# Altium schematic sheet circuit_print_NCKH.SchDoc
size A4
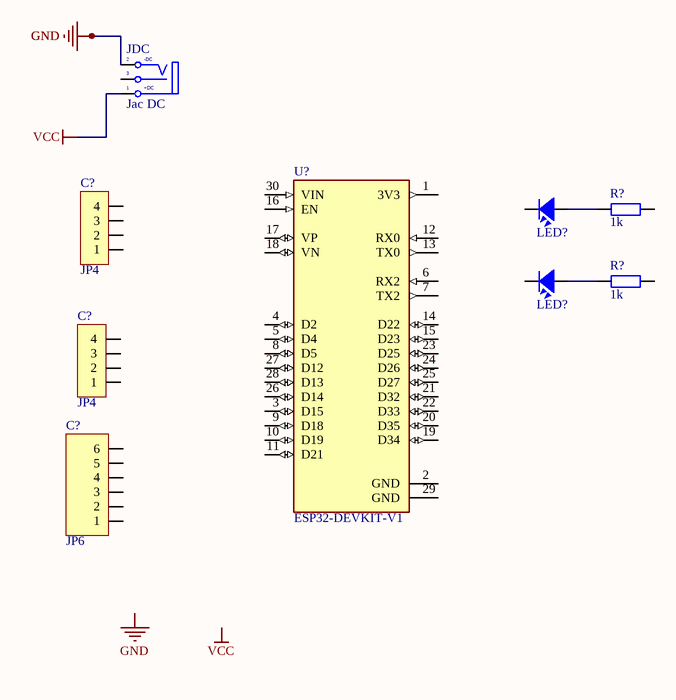
[diagram p0: circuit_print_NCKH.SchDoc]

## Parts
(Parts that share a designator on the sheet are numbered #1, #2 ... from top to bottom, then left to right.)
C?#1  JP4  [JP4-C1T]
C?#2  JP4  [JP4-C1T]
C?#3  JP6  [JP6-C1T]
JDC  Jac DC  [DC0]
LED?#1  LED  [LED-5-RED]  (value not drawn)
LED?#2  LED  [LED-5-RED]  (value not drawn)
R?#1  1k  [R1/4W]
R?#2  1k  [R1/4W]
U?  ESP32-DEVKIT-V1  [MODULE_ESP32_DEVKIT_V1]

## Nets
GND: JDC.2(TN)
VCC: JDC.1(T)
NetLED?#1_1: LED?#1.1 R?#1.1
NetLED?#2_1: LED?#2.1 R?#2.1

Not connected (* = marked no-connect by the designer): C?#1 1 2 3 4; C?#2 1 2 3 4; C?#3 1 2 3 4 5 6; JDC 3(S); LED?#1 2; LED?#2 2; R?#1 2; R?#2 2; U? 1(3V3) 2(GND) 3(D15) 4(D2) 5(D4) 6(RX2) 7(TX2) 8(D5) 9(D18) 10(D19) 11(D21) 12(RX0) 13(TX0) 14(D22) 15(D23) 16(EN) 17(VP) 18(VN) 19(D34) 20(D35) 21(D32) 22(D33) 23(D25) 24(D26) 25(D27) 26(D14) 27(D12) 28(D13) 29(GND) 30(VIN)

## Notes on the sheet
- Labels drawn without touching a wire or pin: GND, VCC
- (in symbol DCIN) -DC; +DC

## Library data of the parts
C?#1 C?#2 = JP4: WR-PHD 2.54 mm Angled Socket Header; Manufacturer: W¨¹rth Elektronik eiSos GmbH; partNo: 613004143121; ComponentLink1 Description: Manufacturer; ComponentLink2 Description: Datasheet; NoPins: 04; Created Date: 29 March 2013; ComponentLink1URL: http://www.we-online.com; ComponentLink2URL: http://katalog.we-online.de/em/datasheet/6130xx143121.pdf; Created by: Karrer Zheng
C?#3 = JP6: WR-PHD 2.54 mm Angled Socket Header; Manufacturer: W¨¹rth Elektronik eiSos GmbH; partNo: 613006143121; ComponentLink1 Description: Manufacturer; ComponentLink2 Description: Datasheet; NoPins: 06; Created Date: 29 March 2013; ComponentLink1URL: http://www.we-online.com; ComponentLink2URL: http://katalog.we-online.de/em/datasheet/6130xx143121.pdf; Created by: Karrer Zheng
JDC = DCIN: Jac DC input; Value: Jac DC
LED?#1 LED?#2 = LED: LED Single colour Green and Red; Value: LED 3 ly Single Colour
R?#1 R?#2 = R1/4W: Resistor 1/4W; Value: R1/4W - 1K
U? = ESP32-DEVKIT-V1: Dual core, Wi-Fi: 2.4 GHz up to 150 Mbits/s,BLE (Bluetooth Low Energy) and legacy Bluetooth, 32 bits, Up to 240 MHz; MF: Do it; Value: *; MP: ESP32-DEVKIT-V1; SnapEDA_Link: https://www.snapeda.com/parts/ESP32-DEVKIT-V1/Do+it/view-part/?ref=snap; Price: None; Package: None; Check_prices: https://www.snapeda.com/parts/ESP32-DEVKIT-V1/Do+it/view-part/?ref=eda; Availability: Not in stock